# Altium schematic sheet high_side_switch.SchDoc
size A4
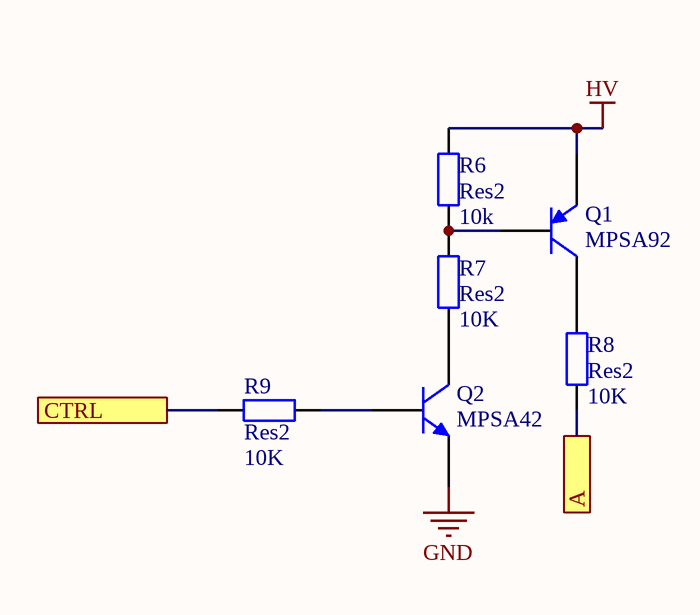
[diagram p0: high_side_switch.SchDoc]

## Parts
Q1  MPSA92  [TO-92 bent leads]
Q2  MPSA42  [TO-92 bent leads]
R6  Res2  value 10k  [0402_res]
R7  Res2  value 10K  [0402_res]
R8  Res2  value 10K  [0402_res]
R9  Res2  value 10K  [0402_res]

## Ports
A, CTRL

## Nets
GND: Q2.3(E)
HV: Q1.3(E) R6.2
A: R8.1 ; port A
CTRL: R9.2 ; port CTRL
NetQ1_1: Q1.1(C) R8.2
NetQ1_2: Q1.2(B) R6.1 R7.2
NetQ2_1: Q2.1(C) R7.1
NetQ2_2: Q2.2(B) R9.1

## Library data of the parts
Q1 = PNP: PNP Bipolar Transistor; Published: 8-Jun-2000; LatestRevisionDate: 29-May-2009; LatestRevisionNote: IPC-7351 Footprint Added.; PackageVersion: Aug-1999; PackageReference: SOT-23B; Publisher: Altium Limited; PackageDescription: 3-Pin SOT-23 Package 0.95 mm Pitch, 2.4 mm Lead Span
Q2 = NPN: NPN Bipolar Transistor; Published: 8-Jun-2000; LatestRevisionDate: 17-Jul-2002; LatestRevisionNote: Re-released for DXP Platform.; PackageReference: TO-226-AA; Publisher: Altium Limited; PackageDescription: TO, Flat Index; 3 In-Line, Axial Leads; Body Dia. 4.8mm; Leads 0.55 x 0.51 mm (max); Code_JEDEC: TO-226-AA
R6-R9 = Res2: Resistor; Published: 8-Jun-2000; LatestRevisionDate: 17-Jul-2002; LatestRevisionNote: Re-released for DXP Platform.; PackageReference: AXIAL-0.4; Publisher: Altium Limited; PackageDescription: Axial Device, Thru-Hole; 2 Leads; 0.4 in Pin Spacing